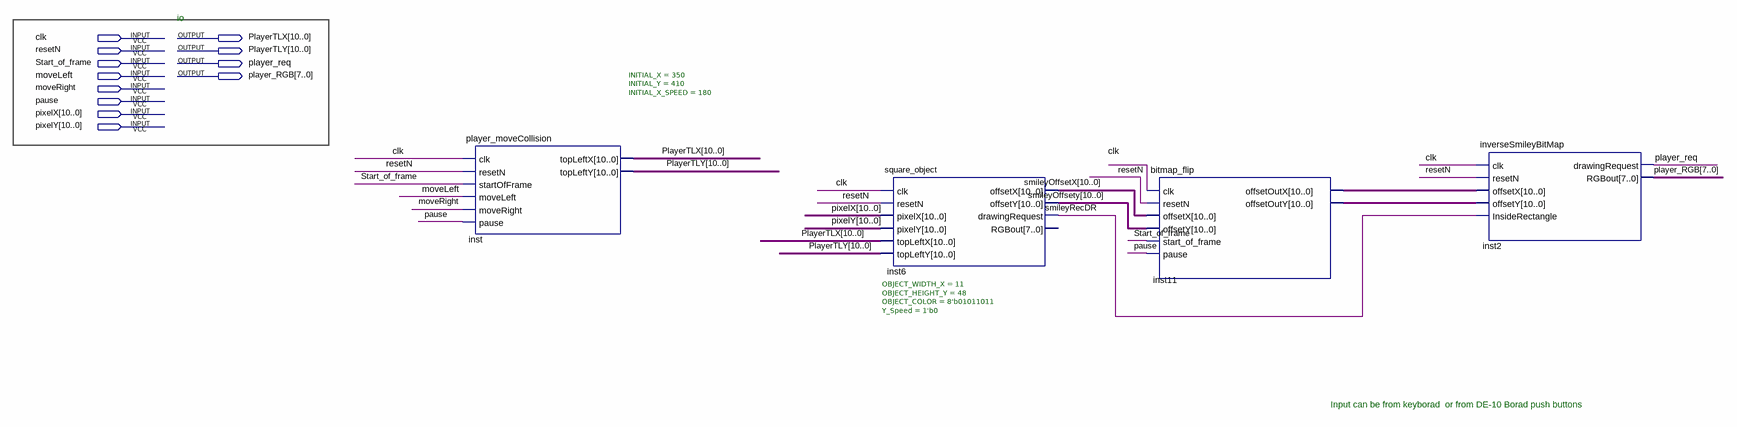
[diagram p0: schematic sheet]
// Quartus schematic TOP_PLAYER.bdf as structural Verilog: 4 symbols, 12 pins
module TOP_PLAYER (
  input  clk,
  input  resetN,
  input  Start_of_frame,
  input  moveLeft,
  input  moveRight,
  input  pause,
  input  [10:0] pixelX,
  input  [10:0] pixelY,
  output [10:0] PlayerTLX,
  output [10:0] PlayerTLY,
  output player_req,
  output [7:0] player_RGB
);

  wire smileyRecDR;
  wire [10:0] inst11_offsetoutx, inst11_offsetouty, smileyOffsetX, smileyOffsety;

  player_moveCollision #(.INITIAL_X(350), .INITIAL_Y(410), .INITIAL_X_SPEED(180)) inst (
    .clk(clk), .resetN(resetN), .startOfFrame(Start_of_frame), .moveLeft(moveLeft), .moveRight(moveRight),
    .pause(pause), .topLeftX(PlayerTLX), .topLeftY(PlayerTLY));
  square_object #(.OBJECT_WIDTH_X(11), .OBJECT_HEIGHT_Y(48), .OBJECT_COLOR(8'b01011011), .Y_Speed(1'b0)) inst6 (
    .clk(clk), .resetN(resetN), .pixelX(pixelX), .pixelY(pixelY), .topLeftX(PlayerTLX), .topLeftY(PlayerTLY),
    .offsetX(smileyOffsetX), .offsetY(smileyOffsety), .drawingRequest(smileyRecDR));  // open: RGBout
  bitmap_flip inst11 (
    .clk(clk), .resetN(resetN), .offsetX(smileyOffsetX), .offsetY(smileyOffsety),
    .start_of_frame(Start_of_frame), .pause(pause), .offsetOutX(inst11_offsetoutx),
    .offsetOutY(inst11_offsetouty));
  inverseSmileyBitMap inst2 (
    .clk(clk), .resetN(resetN), .offsetX(inst11_offsetoutx), .offsetY(inst11_offsetouty),
    .InsideRectangle(smileyRecDR), .drawingRequest(player_req), .RGBout(player_RGB));

  // Notes on the sheet:
  //   io
  //   Input can be from keyborad  or from DE-10 Borad push buttons  
endmodule
